# Altium project TallyLight.PrjPcb
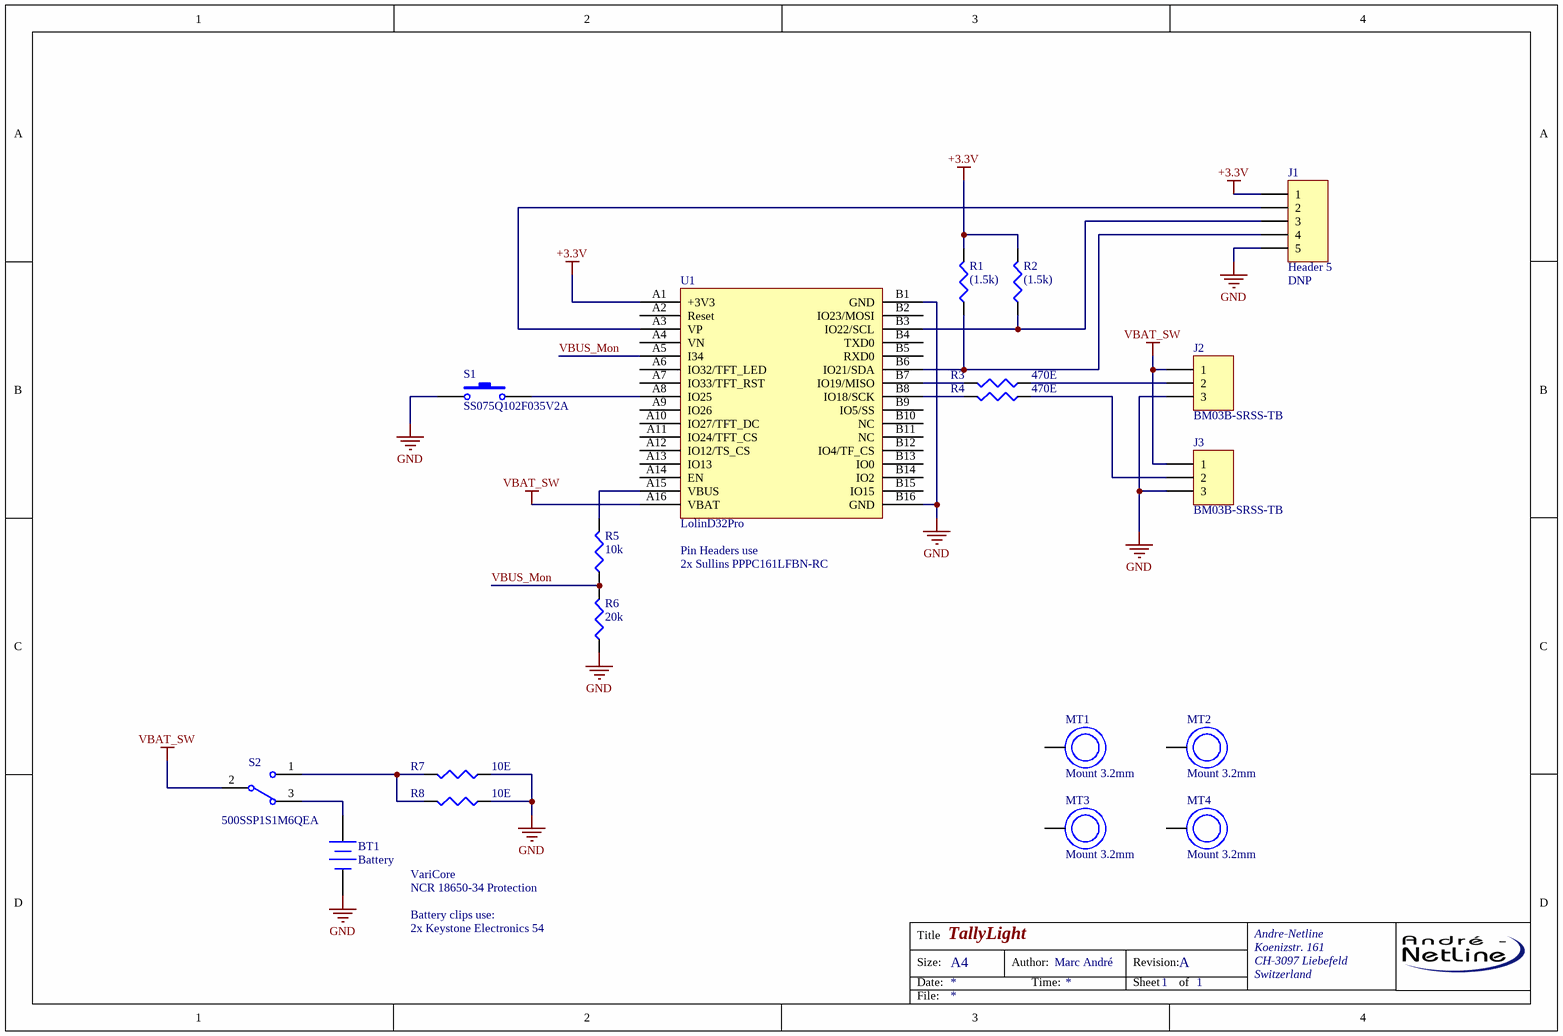
[diagram p0: TallyLight.SchDoc]
1 sheet, 19 parts. Net scope: global (net labels, ports and power ports of the same name join across sheets).
Board file: TallyLight2.PcbDoc

## Sheet TallyLight.SchDoc: TallyLight
size A4; Author: Marc André; Organization: Andre-Netline; Address1: Koenizstr. 161; Address2: CH-3097 Liebefeld; Address3: Switzerland; Revision: A; SheetNumber: 1; SheetTotal: 1

### Parts
BT1  Battery  [Bat18650B]
J1  Header 5  [HDR1X5]
J2  BM03B-SRSS-TB  [BM03B-SRSS-TB]
J3  BM03B-SRSS-TB  [BM03B-SRSS-TB]
MT1  Mount 3.2mm  [MT]
MT2  Mount 3.2mm  [MT]
MT3  Mount 3.2mm  [MT]
MT4  Mount 3.2mm  [MT]
R1  (1.5k)  [R0402]
R2  (1.5k)  [R0402]
R3  470E  [R0402]
R4  470E  [R0402]
R5  10k  [R0402]
R6  20k  [R0402]
R7  10E  [R0603]
R8  10E  [R0603]
S1  SS075Q102F035V2A  [SS075Q102F035V2A]
S2  500SSP1S1M6QEA  [500SSPxS2M6xEA]
U1  LolinD32Pro  [LolinD32Pro]

### Nets
+3.3V: J1.1 R1.2 R2.2 U1.A1(+3V3)
GND: BT1.2(-) J1.5 J2.3 J3.3 R6.1 R7.1 R8.1 S1.1 U1.B1(GND) U1.B16(GND)
VBAT_SW: J2.1 J3.1 S2.2 U1.A16(VBAT)
VBUS_Mon: R5.1 R6.2 U1.A5(I34)
NetBT1_1: BT1.1(+) S2.3
NetJ1_2: J1.2 U1.A3(VP)
NetJ1_3: J1.3 R2.1 U1.B3(IO22/SCL)
NetJ1_4: J1.4 R1.1 U1.B6(IO21/SDA)
NetJ2_2: J2.2 R3.1
NetJ3_2: J3.2 R4.1
NetR3_2: R3.2 U1.B7(IO19/MISO)
NetR4_2: R4.2 U1.B8(IO18/SCK)
NetR5_2: R5.2 U1.A15(VBUS)
NetR7_2: R7.2 R8.2 S2.1
NetS1_2: S1.2 U1.A8(IO25)

Not connected (* = marked no-connect by the designer): MT1 1; MT2 1; MT3 1; MT4 1; U1 A2(Reset) A4(VN) A6(IO32/TFT_LED) A7(IO33/TFT_RST) A9(IO26) A10(IO27/TFT_DC) A11(IO24/TFT_CS) A12(IO12/TS_CS) A13(IO13) A14(EN) B2(IO23/MOSI) B4(TXD0) B5(RXD0) B9(IO5/SS) B10(NC) B11(NC) B12(IO4/TF_CS) B13(IO0) B14(IO2) B15(IO15)

### Notes on the sheet
- (near J1) DNP
- (near U1) Pin Headers use
- 2x Sullins PPPC161LFBN-RC
- Battery clips use:
- NCR 18650-34 Protection
- VariCore
- 2x Keystone Electronics 54
- Title
- Size:
- Date:
- A4
- Author:
- Time:
- Revision:
- Sheet
- of
- File:

### Library data of the parts
BT1 = Battery: Multicell Battery; Manufacturer: Varicore; Manufacturer Part Number: NCR 18650-34 Protection; Published: 24-Mar-1999; LatestRevisionDate: 17-Jul-2002; LatestRevisionNote: Re-released for DXP Platform.; PackageReference: BAT-2; Publisher: Altium Limited; PackageDescription: Battery; 2 Leads; Fitted: Fitted
J1 = Header 5: Header, 5-Pin; Fitted: Not Fitted; LatestRevisionDate: 17-Jul-2002; LatestRevisionNote: Re-released for DXP Platform.; Publisher: Altium Limited
J2 J3 = Header 3: CONN HEADER SMD 3POS 1MM; Manufacturer: JST; Manufacturer Part Number: BM03B-SRSS-TB(LF)(SN); LatestRevisionDate: 17-Jul-2002; LatestRevisionNote: Re-released for DXP Platform.; Publisher: Altium Limited; Fitted: Fitted
MT1-MT4 = MountingHole: Mounting hole 3.2mm, 5.7mm pad; Fitted: Not Fitted
R1 R2 = RES 0402: RES SMD 1.5K OHM 1% 1/10W 0402; Manufacturer: Panasonic; Manufacturer Part Number: ERJ-2RKF1501X; Fitted: Not Fitted; Value: (1.5k)
R3 R4 = RES 0402: RES SMD 470 OHM 1% 1/10W 0402; Manufacturer: Panasonic; Manufacturer Part Number: ERJ-2RKF4700X; Fitted: Fitted; Value: 470E
R5 = RES 0402: RES SMD 10K OHM 1% 1/10W 0402; Manufacturer: Panasonic; Manufacturer Part Number: ERJ-2RKF1002X; Fitted: Fitted; Value: 10k
R6 = RES 0402: RES SMD 20K OHM 1% 1/10W 0402; Manufacturer: Panasonic; Manufacturer Part Number: ERJ-2RKF2002X; Fitted: Fitted; Value: 20k
R7 R8 = RES 0402: RES 10 OHM 1% 1/10W 0603; Manufacturer: Panasonic; Manufacturer Part Number: Stackpole Electronics Inc; Fitted: Fitted; Value: 10E
S1 = SW-PB: SWITCH SNAP ACT SPDT 100MA 125V; Manufacturer: E-Switch; Published: 24-Mar-1999; LatestRevisionDate: 17-Jul-2002; LatestRevisionNote: Re-released for DXP Platform.; PackageReference: SPST-2; Publisher: Altium Limited; PackageDescription: Switch; 2 Leads; Fitted: Fitted; Manufacturer Part Number: SS075Q102F035V2A
S2 = SW-SPDT: SWITCH SLIDE SPDT 5A 120V; Manufacturer: E-Switch; Published: 24-Mar-1999; LatestRevisionDate: 17-Dec-2003; LatestRevisionNote: Schematic revised, PCB Footprint replaced.; DatasheetVersion: 05-Dec-2000; PackageReference: TL36WW15050; Publisher: Altium Limited; PackageDescription: Switch; 4 Leads; ComponentLink1Description: Manufacturer Link; ComponentLink1URL: http://www.apem.com; Manufacturer Part Number: 500SSP1S1M6QEA; Fitted: Fitted
U1 = LolinD32Pro: ESP32 board; Manufacturer: Wemos; Fitted: Fitted; Manufacturer Part Number: LolinD32Pro